# Altium schematic sheet Processor.SchDoc: ZStation Processor
size A4; Engineer: Stephan Eersels; DocumentNumber: 12202925_ZS; Revision: 2.1; SheetNumber: 1; SheetTotal: 8
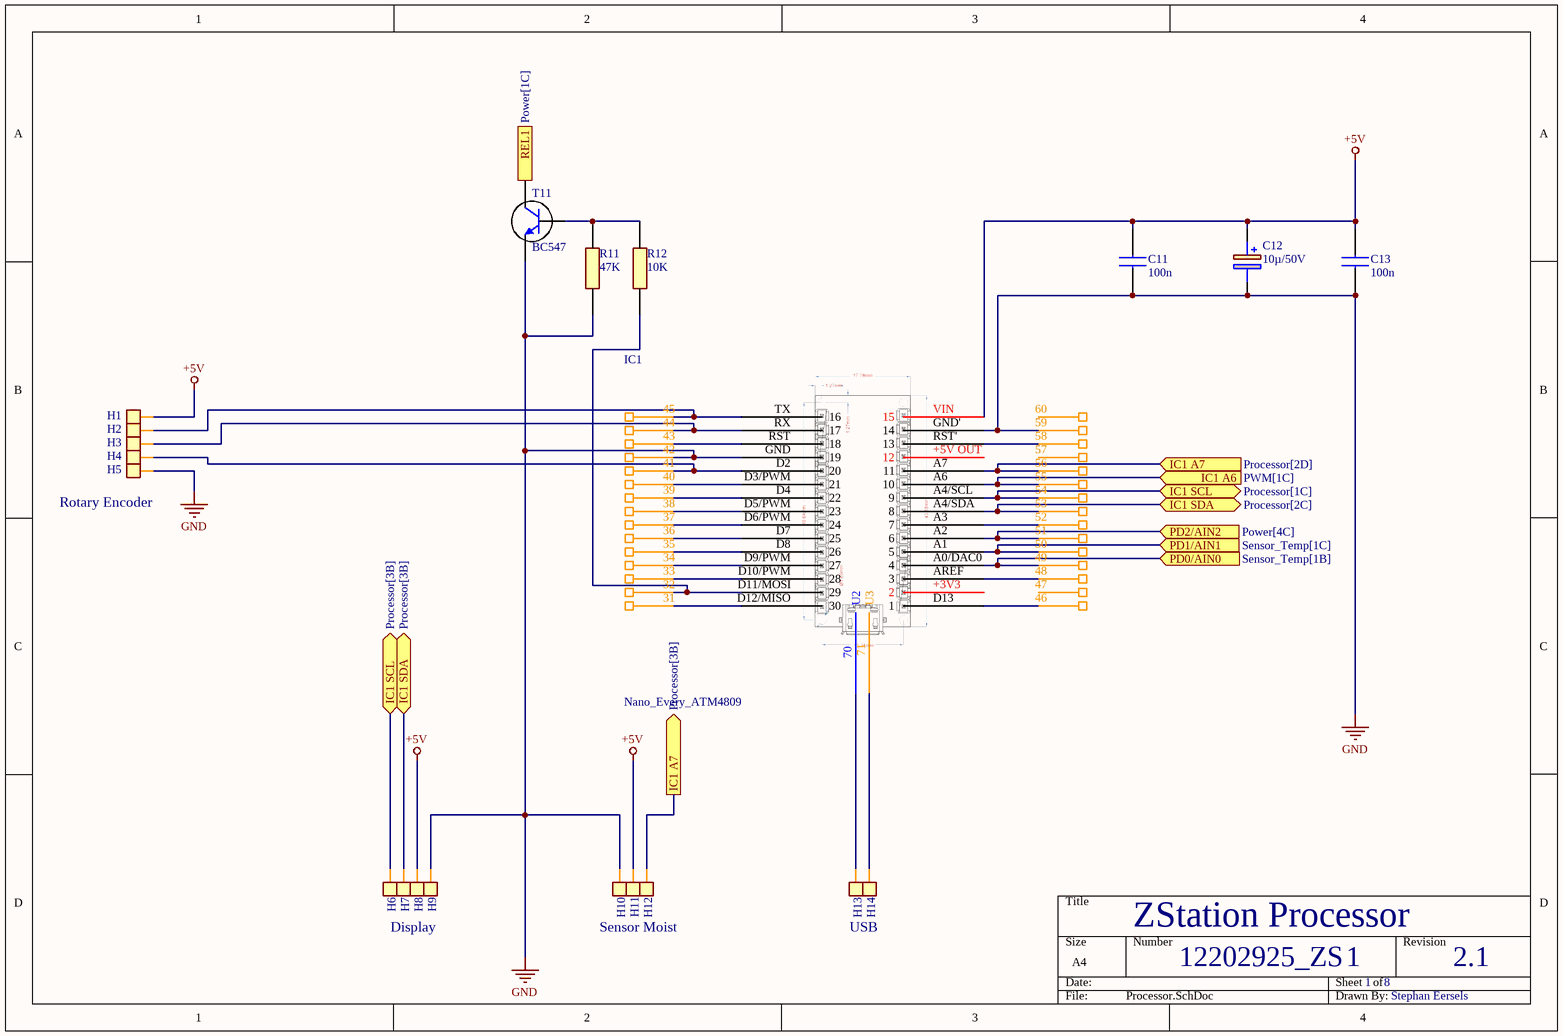
[diagram p0: Processor.SchDoc]

## Parts
C11  100n  [RDE5C1H330J0M1H03A]
C12  10µ/50V  [CAPPRD200W50D525H1250]
C13  100n  [RDE5C1H330J0M1H03A]
H1  HFS  [Header_F_S]  (value not drawn)
H2  HFS  [Header_F_S]  (value not drawn)
H3  HFS  [Header_F_S]  (value not drawn)
H4  HFS  [Header_F_S]  (value not drawn)
H5  HFS  [Header_F_S]  (value not drawn)
H6  HFS  [Header_F_S]  (value not drawn)
H7  HFS  [Header_F_S]  (value not drawn)
H8  HFS  [Header_F_S]  (value not drawn)
H9  HFS  [Header_F_S]  (value not drawn)
H10  HFS  [Header_F_S]  (value not drawn)
H11  HFS  [Header_F_S]  (value not drawn)
H12  HFS  [Header_F_S]  (value not drawn)
H13  HFS  [Header_F_S]  (value not drawn)
H14  HFS  [Header_F_S]  (value not drawn)
IC1  Nano_Every_ATM4809  [Every_Nano_4809]
R11  47K  [VISHAY_CMF_60]
R12  10K  [VISHAY_CMF_60]
T11  BC547  [ONSC-TO-92-3-29-11]

## Ports
IC1 A6 (in, see PWM[1C]), IC1 A7 (in, see Processor[2D]), IC1 A7 (out, see Processor[3B]), IC1 SCL (bidir, see Processor[1C]), IC1 SCL (bidir, see Processor[3B]), IC1 SDA (bidir, see Processor[2C]), IC1 SDA (bidir, see Processor[3B]), PD0/AIN0 (in, see Sensor_Temp[1B]), PD1/AIN1 (in, see Sensor_Temp[1C]), PD2/AIN2 (in, see Power[4C]), REL1 (in, see Power[1C])

## Nets
+5V: C11.2 C12.1(+) C13.2 H1.1(HF) H8.1(HF) H11.1(HF) IC1.VIN(15)
GND: C11.1 C12.2(-) C13.1 H5.1(HF) H9.1(HF) H10.1(HF) IC1.42(BIS) IC1.59(BIS) IC1.GND(19) IC1.GND'(14) R11.1 T11.3(E)
IC1 A6: IC1.55(BIS) IC1.A6(10) ; port IC1 A6
IC1 A7: H12.1(HF) IC1.56(BIS) IC1.A7(11) ; port IC1 A7
IC1 SCL: H6.1(HF) IC1.54(BIS) IC1.A4/SCL(9) ; port IC1 SCL
IC1 SDA: H7.1(HF) IC1.53(BIS) IC1.A4/SDA(8) ; port IC1 SDA
PD0/AIN0: IC1.49(BIS) IC1.A0/DAC0(4) ; port PD0/AIN0
PD1/AIN1: IC1.50(BIS) IC1.A1(5) ; port PD1/AIN1
PD2/AIN2: IC1.51(BIS) IC1.A2(6) ; port PD2/AIN2
REL1: T11.1(C) ; port REL1
NetH2_1: H2.1(HF) IC1.45(BIS) IC1.TX(16)
NetH3_1: H3.1(HF) IC1.44(BIS) IC1.RX(17)
NetH4_1: H4.1(HF) IC1.41(BIS) IC1.D2(20)
NetH13_1: H13.1(HF) IC1.70(U2)
NetH14_1: H14.1(HF) IC1.71(U3)
NetIC1_31: IC1.31(BIS) IC1.D12/MISO(30)
NetIC1_32: IC1.32(BIS) IC1.D11/MOSI(29) R12.1
NetIC1_33: IC1.33(BIS) IC1.D10/PWM(28)
NetIC1_34: IC1.34(BIS) IC1.D9/PWM(27)
NetIC1_35: IC1.35(BIS) IC1.D8(26)
NetIC1_36: IC1.36(BIS) IC1.D7(25)
NetIC1_37: IC1.37(BIS) IC1.D6/PWM(24)
NetIC1_38: IC1.38(BIS) IC1.D5/PWM(23)
NetIC1_39: IC1.39(BIS) IC1.D4(22)
NetIC1_40: IC1.40(BIS) IC1.D3/PWM(21)
NetIC1_43: IC1.43(BIS) IC1.RST(18)
NetIC1_46: IC1.46(BIS) IC1.D13(1)
NetIC1_48: IC1.48(BIS) IC1.AREF(3)
NetIC1_52: IC1.52(BIS) IC1.A3(7)
NetIC1_58: IC1.58(BIS) IC1.RST'(13)
NetR11_2: R11.2 R12.2 T11.2(B)

Not connected (* = marked no-connect by the designer): IC1 47(BIS) 57(BIS) 60(BIS) +3V3(2) +5V OUT(12)

## Notes on the sheet
- Rotary Encoder
- Display
- Sensor Moist
- USB

## Library data of the parts
C11 C13 = C315C103K5R5TA7303: GoldMax 300 Comm X7R, Ceramic, 0.01 uF, 10%, 50 VDC, 125 VDC, 125C, -55C, X7R, GoldMax, Commercial Standard, 2.5 % , 100 GOhms, 3.81mm, 3.14mm, 2.54mm, Lead Spacing = 2.54mm, 18mm, 0.51mm, 2500, 80; Manufacturer_Name: KEMET; Geometry.Height: 4.66mm; Mouser Part Number: 80-C315C103K5R-TR; Mouser Price/Stock: https://www.mouser.co.uk/ProductDetail/KEMET/C315C103K5R5TA7303?qs=LJ1pyEEo5rYBfSJP9%252BZ%252BkA%3D%3D; Manufacturer_Part_Number: C315C103K5R5TA7303; Datasheet Link: https://content.kemet.com/datasheets/KEM_C1050_GOLDMAX_X7R.pdf
C12 = UKL1H100KDDANA: Cap Aluminum Lytic 10uF 50V 10% (5 X 11mm) Radial 2mm 70mA 1000h 105C; Manufacturer_Name: Nichicon; Geometry.Height: 12.5mm; Mouser Part Number: 647-UKL1H100KDDANA; Mouser Price/Stock: https://www.mouser.co.uk/ProductDetail/Nichicon/UKL1H100KDDANA/?qs=LEOMo9F8%2FjG8Wr15FZX2LA%3D%3D; Manufacturer_Part_Number: UKL1H100KDDANA; Datasheet Link: https://datasheet.datasheetarchive.com/originals/dk/DKDS-9/176714.pdf
H1-H14 = Head_F_S
R11 R12 = RES_68K_10K: Through Hole 1W 10/68 Kohms 1%; Manufacturer_Name: Vishay; Manufacturer_Part_Number: CMF6010K000FKEB; Mouser Part Number: 71-CMF6010K000FKEB; Mouser Price/Stock: https://www.mouser.co.uk/ProductDetail/Vishay-Dale/CMF6010K000FKEB?qs=GEEnpASSx%2Fgpk8SPxIuFzw%3D%3D; Datasheet Link: https://datasheet.datasheetarchive.com/originals/distributors/Datasheets-DGA8/3123891.pdf; Arrow Part Number: CMF6010K000FKEB; Arrow Price/Stock: https://www.arrow.com/en/products/cmf6010k000fkeb/vishay
T11 = Transistor_NPN: Manufacturer: On Semiconductor; PartNumber: BC547C; IC Continuous (A): 0.1; fT Min (MHz): 150; Packing: Bulk Box; Polarity: NPN; Mounting Technology: Through Hole; ComponentLink1URL: http://www.onsemi.com/; ComponentLink1Description: Manufacturer URL; ComponentLink3URL: http://www.onsemi.cn/pub_link/Collateral/2N6426-D.PDF; DatasheetVersion: Rev. 7; PackageVersion: Rev. AM; RoHS: FALSE; ComponentLink2URL: http://www.onsemi.com/pub_link/Collateral/BC546-D.PDF; ComponentLink3Description: Package Specification; PackageDescription: 3-Pin Transistor Outline, Body 4.825 x 3.685 mm, Pitch 1.27 mm; PackageReference: TO-92-3-29-11_AM_SL; ComponentLink2Description: Datasheet